# EAGLE design ctrlm_v1p1 (EAGLE 5.10)
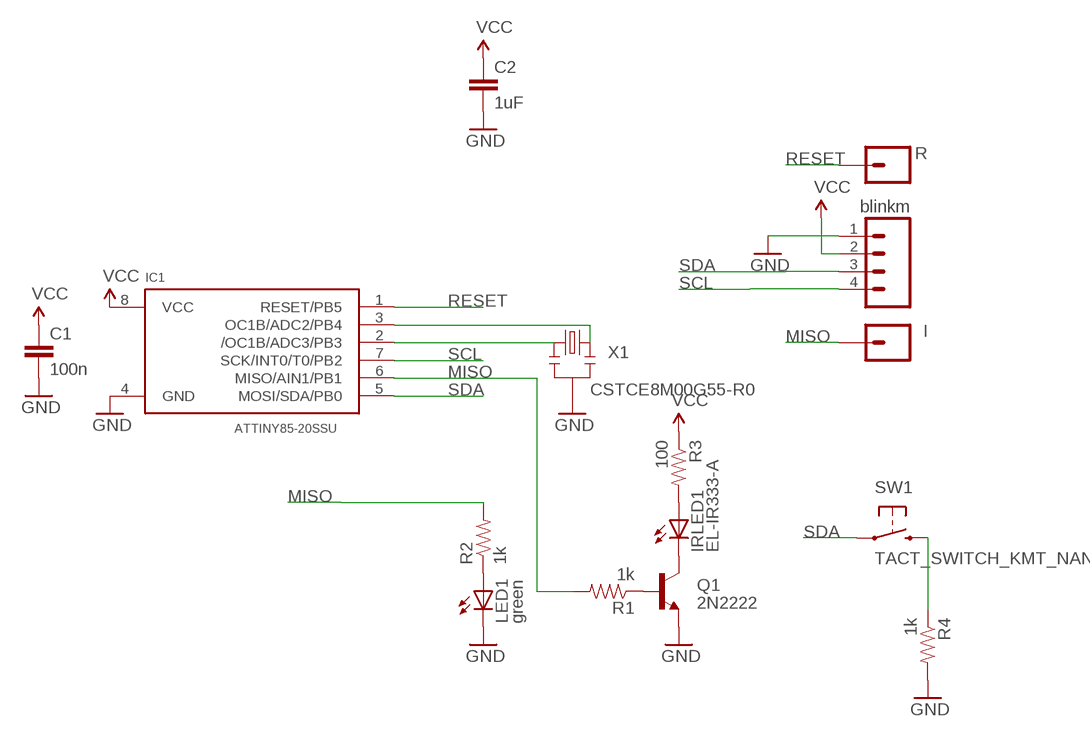
[diagram p0: schematic, sheet 1]

## Parts
C1  100n  CAP0603-CAP  [0603-CAP]
C2  1uF  CAP0805  [0805]
I  M01PTH  [1X01]
IC1  ATTINY85-20SSU  ATTINY45SOIC  [SO08-EIAJ]
IRLED1  EL-IR333-A  LED5MM  [LED5MM]
JP1  blinkm  M04LOCK  [1X04_LOCK]
LED1  green  LED0603  [LED-0603]
Q1  2N2222  TRANSISTOR_NPNSOT23-3  [SOT23-3]
R  M01PTH  [1X01]
R1  1k  RESISTOR0603-RES  [0603-RES]
R2  1k  RESISTOR0603-RES  [0603-RES]
R3  100  RESISTOR0603-RES  [0603-RES]
R4  1k  RESISTOR0603-RES  [0603-RES]
SW1  TACT_SWITCH_KMT_NANO  [TACT_SWITCH_KMT_NANO]
X1  CSTCE8M00G55-R0  RESONATORSMD  [RESONATOR-SMD]

## Nets
GND: C1.2 C2.2 IC1.4(GND) JP1.1 LED1.C Q1.2(E) R4.2 X1.2
MISO: I.1 IC1.6(MISO/AIN1/PB1) R1.2 R2.2
N$1: LED1.A R2.1
N$2: Q1.1(B) R1.1
N$3: IRLED1.K(C) Q1.3(C)
N$4: IC1.2(/OC1B/ADC3/PB3) X1.1
N$5: IC1.3(OC1B/ADC2/PB4) X1.3
N$7: IRLED1.A R3.2
N$8: R4.1 SW1.P2@1
RESET: IC1.1(RESET/PB5) R.1
SCL: IC1.7(SCK/INT0/T0/PB2) JP1.4
SDA: IC1.5(MOSI/SDA/PB0) JP1.3 SW1.P1@1
VCC: C1.1 C2.1 IC1.8(VCC) JP1.2 R3.1

## Library data of the parts
C1 C2 = SparkFun-20091103:CAP: Capacitor Standard 0603 ceramic capacitor, and 0.1" leaded capacitor.
I R = SparkFun-20091103:M01: Header 1 Standard 1-pin 0.1" header. Use with straight break away headers (SKU : PRT-00116), right angle break away headers (PRT-00553), swiss pins (PRT-00743), machine pins (PRT-00117), and female headers (PRT-00115).
IC1 = todstuff:ATTINY45
IRLED1 LED1 = SparkFun-20091103:LED: LEDs Standard schematic elements and footprints for 5mm, 3mm, 1206, and 0603 sized LEDs. 5mm - Spark Fun Electronics SKU : COM-00529 (and others)
JP1 = SparkFun-20091103:M04: Header 4 Standard 4-pin 0.1" header. Use with straight break away headers (SKU : PRT-00116), right angle break away headers (PRT-00553), swiss pins (PRT-00743), machine pins (PRT-00117), and female headers (PRT-00115). Molex polarized connector foot print use with SKU : PRT-08231 with associated crimp pins and housings.
Q1 = SparkFun-20091103:TRANSISTOR_NPN: Transistor NPN BJT configuration in SOT23 package. MMBT2222 is the common NPN we use. Double check BCE configuration again layout.
R1-R4 = SparkFun-20091103:RESISTOR: Resistor Basic schematic elements and footprints for 0603, 1206, and PTH 1/10th watt (small) resistors.
SW1 = todstuff:TACT_SWITCH_KMT_NANO
X1 = SparkFun-20090330:RESONATOR: Resonator Small SMD resonator. This is the itty bitty 10/20MHz resonators with built in caps. CSTCE10M0G55 and CSTCE20M0V53. Footprint has been reviewed closely but hasn't been tested yet.

## Board
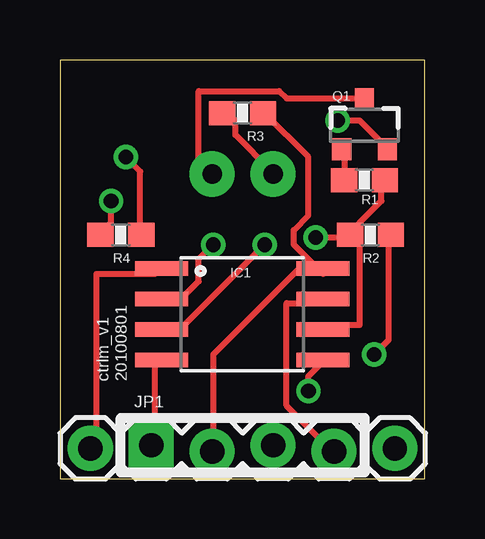
[diagram p1: board, top side]
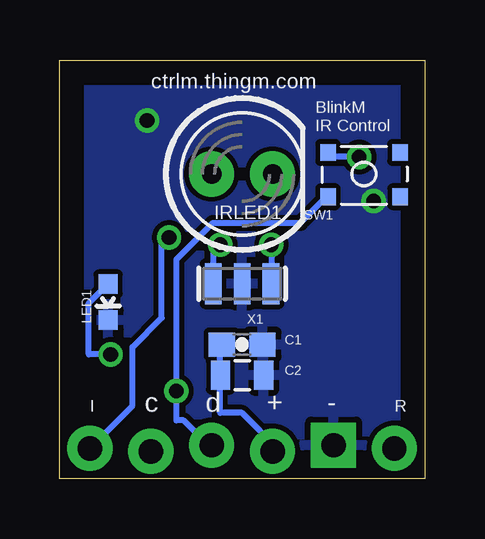
[diagram p2: board, bottom side, seen from below]

Size 15.22 x 17.45 mm. Coordinates in mm from the lower left corner, seen from the top.
Outline: 0,0 15.22,0 15.22,17.45 0,17.45 0,0
Copper layers (1*16): Top 0.035mm / dielectric 1.5mm / Bottom 0.035mm
Design rules "default *": minimum track width 10mil, minimum drill 24mil, track to track 8mil, track to pad 8mil, pad to pad 8mil, via to via 8mil, smd to smd 8mil, copper to edge 40mil, drill to drill 8mil, minimum pad ring 10mil, minimum via ring 8mil, stop-mask expansion 4mil, vias tented up to drill 24mil, thermal gap 10mil

### Footprints (pad centres in the part's own frame; a part is rotated, then mirrored left to right if it is on the bottom)
0603-CAP = smd 1.1 x 1: 1 -0.85,0; 2 0.85,0
0805 = smd 0.8 x 1.2: 1 -0.9,0; 2 0.9,0
1X01 = drill 1.016 pad 1.88 round: 1 0,0
SO08-EIAJ = smd 0.61 x 2.21: 1 -1.905,-3.378; 2 -0.635,-3.378; 3 0.635,-3.378; 4 1.905,-3.378; 5 1.905,3.353; 6 0.635,3.353; 7 -0.635,3.353; 8 -1.905,3.353
LED5MM = drill 0.813 pad 1.88 round: A -1.27,0; K 1.27,0
1X04_LOCK = drill 1.016 pad 1.88 square: 1 0,0.127 | drill 1.016 pad 1.88 round: 2 2.54,-0.127; 3 5.08,0.127; 4 7.62,-0.127
LED-0603 = smd 0.8 x 0.8: A 0,-0.75; C 0,0.75
SOT23-3 = smd 0.8 x 0.9: 1 -0.95,-1; 2 0.95,-1; 3 0,1.1
0603-RES = smd 1.1 x 1: 1 -0.85,0; 2 0.85,0
TACT_SWITCH_KMT_NANO = smd 0.65 x 0.7: P1@1 -1.5,-0.95; P1@2 1.5,-0.95; P2@1 -1.5,0.9; P2@2 1.5,0.9
RESONATOR-SMD = smd 0.7 x 1.7: 1 -1.2,0; 2 0,0; 3 1.2,0

### Placement (x,y rotation side)
C1  7.62,5.59 0 bottom
C2  7.62,4.32 0 bottom
I  13.97,1.27 0 top
IC1  7.62,6.86 270 top
IRLED1  7.62,12.7 0 bottom
JP1  3.81,1.27 0 top
LED1  13.21,7.37 180 bottom
Q1  12.7,14.73 0 top
R  1.27,1.27 0 top
R1  12.7,12.45 0 top
R2  12.95,10.16 180 top
R3  7.62,15.24 180 top
R4  2.54,10.16 180 top
SW1  2.54,12.7 0 bottom
X1  7.62,8.13 180 bottom

### Tracks (layer width: path | path; a pad name or v marks a point on that pad's centre or on a via)
GND  (via drill 0.61)
  Top 0.254: v11.58,14.94 12.5,14.94 13.41,14.02 Q1.2 | v2.13,11.58 2.13,10.67 1.83,10.36 R4.2 | IC1.4 3.96,4.88 3.96,1.52 JP1.1
  pour Bottom: 0,17.78 20.32,17.78 20.32,-1.27 0,-1.27
MISO  (via drill 0.61)
  Top 0.254: 12.5,10.67 13.41,11.58 13.41,12.19 R1.2 | 12.5,10.67 12.19,10.36 R2.2 11.89,10.06 v10.67,10.06 | 12.5,10.67 12.5,6.4 10.97,6.4 IC1.6
  Bottom 0.254: v10.67,10.06 10.97,10.06 10.97,6.71 12.19,5.49 12.19,3.05 13.72,1.52 I.1
N$1  (via drill 0.61)
  Top 0.254: v13.11,5.18 13.72,5.79 13.72,10.06 R2.1
  Bottom 0.254: v13.11,5.18 14.02,5.18 14.02,7.32 13.41,7.92 LED1.A
N$2
  Top 0.254: Q1.1 11.89,13.72 11.89,12.5 R1.1
N$3
  Top 0.254: Q1.3 12.5,15.85 9.45,15.85 9.14,16.15 5.79,16.15 5.79,13.11 6.1,12.8 IRLED1.K
N$4  (via drill 0.61)
  Top 0.254: v6.4,9.75 5.79,9.14 5.79,8.23 5.18,7.62 4.27,7.62 IC1.2
  Bottom 0.254: v6.4,9.75 6.4,8.23 X1.1
N$5  (via drill 0.61)
  Top 0.254: v8.53,9.75 5.18,6.4 4.27,6.4 IC1.3
  Bottom 0.254: v8.53,9.75 8.84,9.75 8.84,8.23 X1.3
N$7
  Top 0.254: R3.2 7.01,15.24 7.32,14.94 7.32,14.33 8.84,12.8 IRLED1.A
N$8  (via drill 0.61)
  Top 0.254: v2.74,13.41 3.35,12.8 3.35,10.36 R4.1
  Bottom 0.254: v2.74,13.41 3.96,13.41 SW1.P2@1
RESET
  Top 0.254: IC1.1 3.96,8.53 1.52,8.53 1.52,1.52 R.1
SCL
  Top 0.254: IC1.7 10.97,7.32 9.45,7.32 9.45,3.05 11.28,1.22 JP1.4
SDA  (via drill 0.61)
  Top 0.254: v10.36,3.66 10.36,4.27 10.97,4.88 IC1.5
  Bottom 0.254: SW1.P1@1 4.27,11.58 5.18,10.67 8.84,10.67 10.36,9.14 v10.36,3.66 10.36,2.44 10.06,2.44 9.14,1.52 JP1.3
VCC
  Top 0.254: 10.36,9.14 10.97,8.53 IC1.8 | 10.36,9.14 9.75,9.75 9.75,10.36 10.36,10.97 10.36,13.41 8.53,15.24 R3.1 | 10.36,9.14 6.4,5.18 6.4,1.22 JP1.2
  Bottom 0.254: C1.1 8.53,5.49 8.53,4.57 C2.1 8.53,4.27 8.53,2.74 7.62,2.74 6.1,1.22 JP1.2

### Text on the board
tPlace: ctrlm_v1 | 20100801
bPlace: ctrlm.thingm.com | BlinkM | IR Control | - | + | d | c